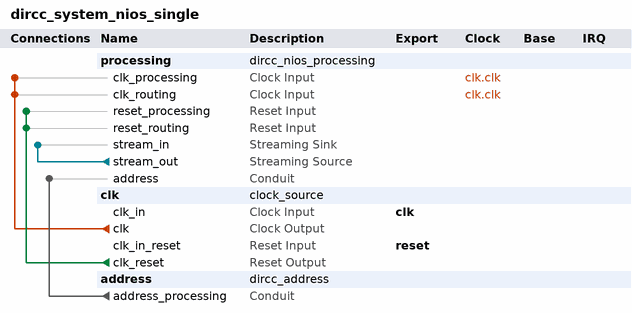
[diagram p0: system contents]
# Platform Designer (Qsys) system dircc_system_nios_single, Cyclone V 5CSEMA5F31C6
# Parameters at their usual value, and those the tool derives, are not listed.
package require -exact qsys 16.1
create_system dircc_system_nios_single
set_project_property DEVICE_FAMILY {Cyclone V}
set_project_property DEVICE 5CSEMA5F31C6

add_instance processing dircc_nios_processing 1.0

add_instance clk clock_source 16.1
set_instance_parameter_value clk clockFrequency 50000000

add_instance address dircc_address 1.0
set_instance_parameter_value address ADDRESS 0

# connections
add_connection clk.clk processing.clk_processing clock
add_connection clk.clk processing.clk_routing clock
add_connection clk.clk_reset processing.reset_processing reset
add_connection clk.clk_reset processing.reset_routing reset
add_connection processing.stream_out processing.stream_in avalon_streaming
add_connection address.address_processing processing.address conduit

# exported interfaces
add_interface clk clock sink
set_interface_property clk EXPORT_OF clk.clk_in
add_interface reset reset sink
set_interface_property reset EXPORT_OF clk.clk_in_reset

set_interconnect_requirement {$system} qsys_mm.clockCrossingAdapter HANDSHAKE
set_interconnect_requirement {$system} qsys_mm.enableEccProtection FALSE
set_interconnect_requirement {$system} qsys_mm.insertDefaultSlave FALSE
set_interconnect_requirement {$system} qsys_mm.maxAdditionalLatency 1

save_system dircc_system_nios_single.qsys
